# EAGLE design p0a-001 (EAGLE 9.6.2)
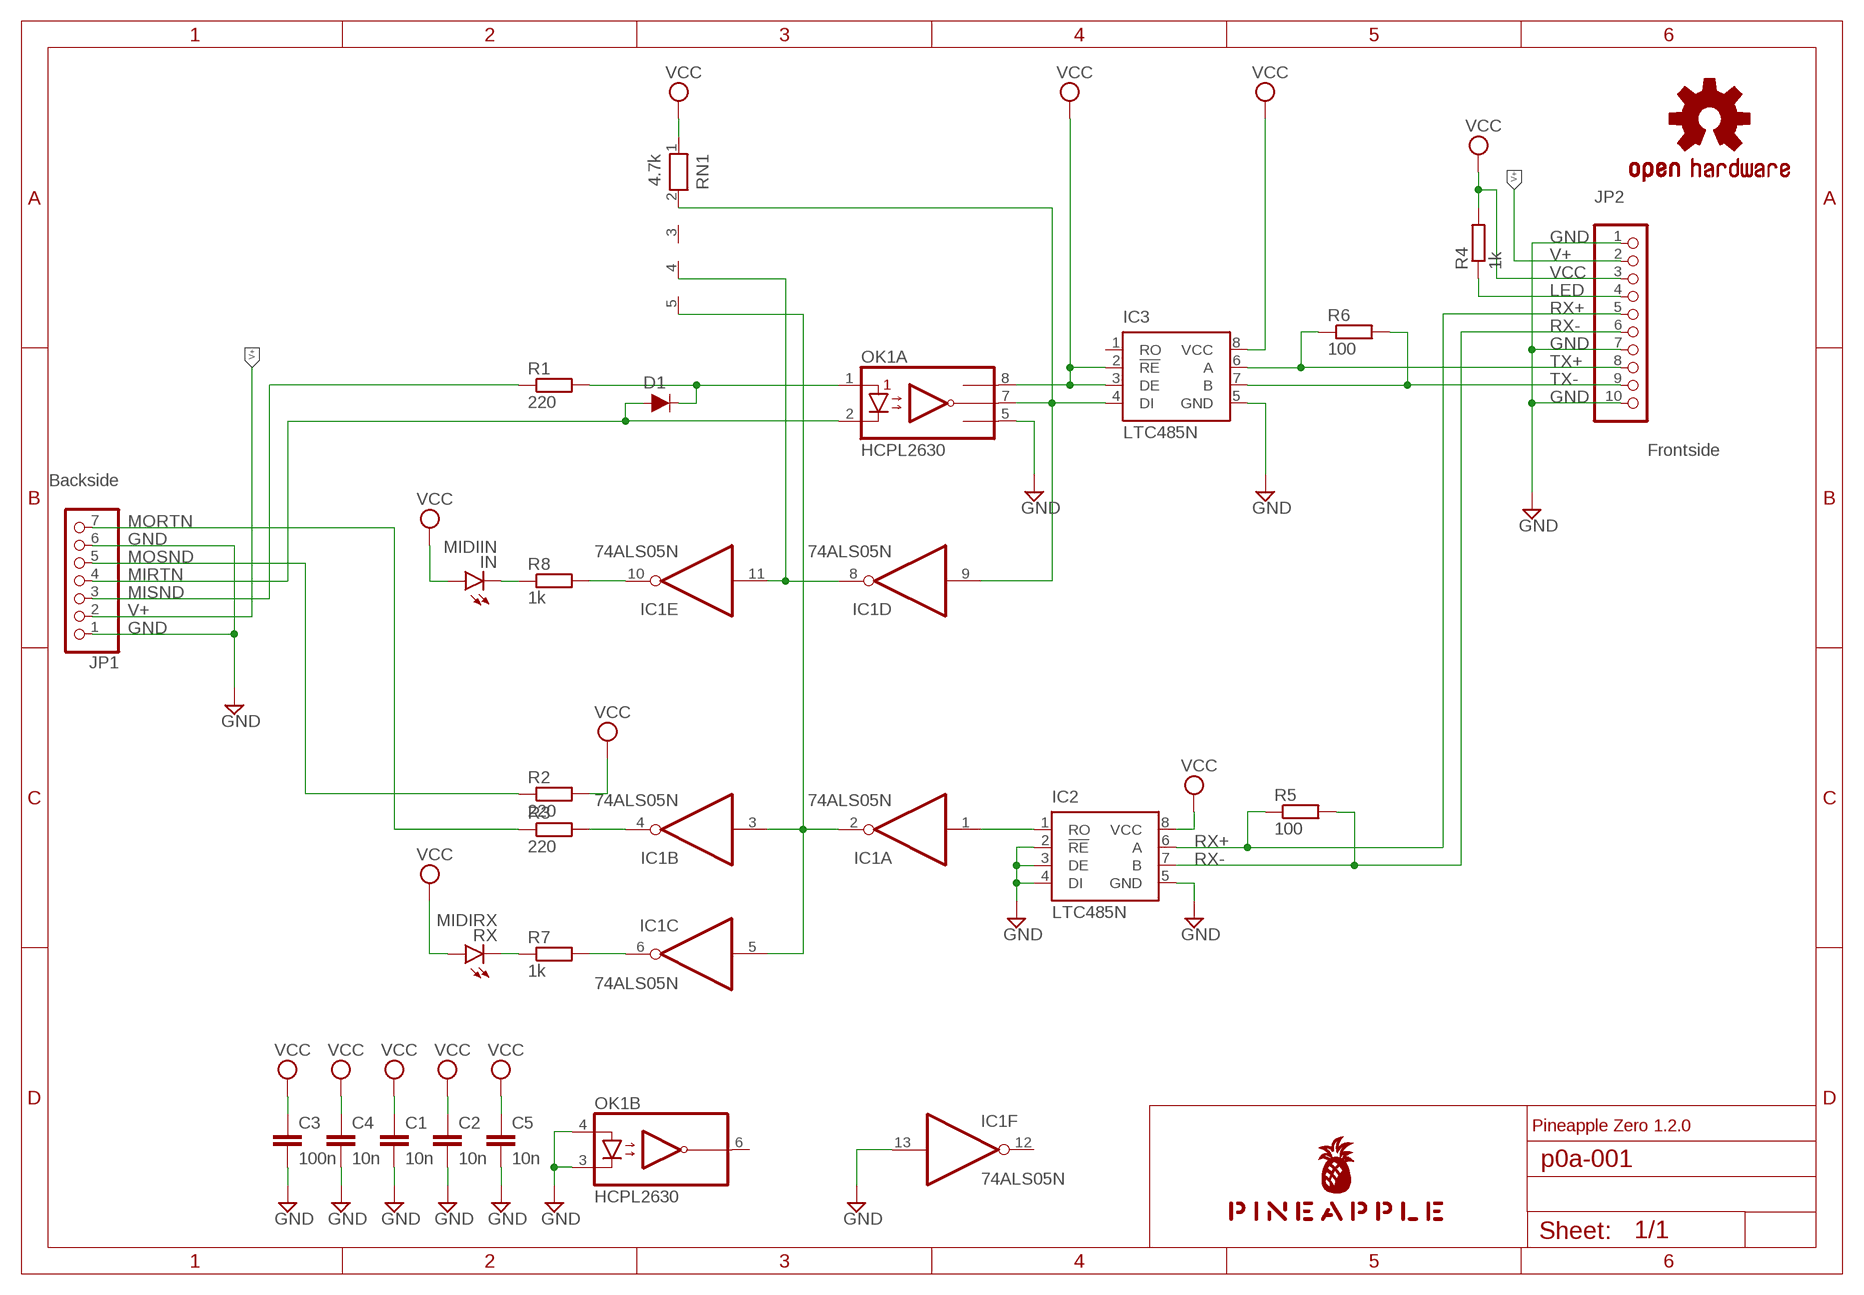
[diagram p0: schematic, sheet 1]

## Parts
C1  10n  C-EU025-024X044  [C025-024X044]
C2  10n  C-EU025-024X044  [C025-024X044]
C3  100n  C-EU025-024X044  [C025-024X044]
C4  10n  C-EU025-024X044  [C025-024X044]
C5  10n  C-EU025-024X044  [C025-024X044]
D1  DIODE-1N4148  [DIODE-1N4148]
IC1  74ALS05N  [DIL14]
IC2  LTC485N  [DIL08]
IC3  LTC485N  [DIL08]
IN  MIDIIN  LEDB152  [Q62902-B152]
JP1  Backside  PINHD-1X7  [1X07]
JP2  Frontside  PINHD-1X10  [1X10]
LOGO1  OSHW-LOGOS-COPPER  [OSHW-LOGO-S_COPPER]
OK1  HCPL2630  [DIL08]
R1  220  R-EU_0204/5  [0204/5]
R2  220  R-EU_0204/5  [0204/5]
R3  220  R-EU_0204/5  [0204/5]
R4  1k  R-EU_0204/5  [0204/5]
R5  100  R-EU_0204/5  [0204/5]
R6  100  R-EU_0204/5  [0204/5]
R7  1k  R-EU_0204/5  [0204/5]
R8  1k  R-EU_0204/5  [0204/5]
RN1  4.7k  RN04  [RN-5]
RX  MIDIRX  LEDB152  [Q62902-B152]
U$1  PINEAPPLE450  [PINEAPPLE450]

## Nets
GND [gnd]: C1.2 C2.2 C3.2 C4.2 C5.2 IC1.13(F:I) IC2.2(!RE) IC2.3(DE) IC2.4(DI) IC2.5(GND) IC3.5(GND) JP1.1 JP1.6 JP2.1 JP2.7 JP2.10 OK1.3(B:C2) OK1.4(B:A2) OK1.5(A:GND)
LED: JP2.4 R4.1
LED1: IC1.6(C:O) R7.2
LED1K: R7.1 RX.K(C)
LED2: IC1.10(E:O) R8.2
LED2K: IN.K(C) R8.1
MIDIIN: D1.C OK1.1(A:A1) R1.2
MIRTN: D1.A JP1.4 OK1.2(A:C1)
MISND: JP1.3 R1.1
MORTN: JP1.7 R3.1
MOSND: JP1.5 R2.1
N$1: IC1.1(A:I) IC2.1(RO)
N$2: IC1.4(B:O) R3.2
N$5: IC1.8(D:O) IC1.11(E:I) RN1.4
NMIDIOUT: IC1.2(A:O) IC1.3(B:I) IC1.5(C:I) RN1.5
RX+: IC2.6(A) JP2.5 R5.1
RX-: IC2.7(B) JP2.6 R5.2
TX: IC1.9(D:I) IC3.4(DI) OK1.7(A:VO1) RN1.2
TX+: IC3.6(A) JP2.8 R6.1
TX-: IC3.7(B) JP2.9 R6.2
V+ [gnd]: JP1.2 JP2.2
VCC [pwr]: C1.1 C2.1 C3.1 C4.1 C5.1 IC2.8(VCC) IC3.2(!RE) IC3.3(DE) IC3.8(VCC) IN.A JP2.3 OK1.8(A:VCC) R2.2 R4.2 RN1.1 RX.A
Unconnected: IC1.12(F:O) IC3.1(RO) OK1.6(B:VO2) RN1.3

## Notes on the sheet
- Pineapple Zero 1.2.0

## Power pins joined to a net without a drawn wire
GND: IC1.7(P:GND)
VCC: IC1.14(P:VCC)

## Library data of the parts
C1-C5 = rcl:C-EU: CAPACITOR, European symbol; SPICEPREFIX: C
D1 = SparkFun-DiscreteSemi:DIODE: Diode These are standard reverse protection diodes and small signal diodes. SparkFun Products: SparkFun SparkPunk Sound Kit <https://www.sparkfun.com/products/11177> SparkFun ESP8266 Thing <https://www.sparkfun.com/products/13231>; PROD_ID: DIO-08378; VALUE: 200mA/100V/1V
IC1 = 74xx-us:74*05: Hex INVERTER, open collector
IC2 IC3 = linear-technology:LTC485: Low Power RS485 Interface Transceiver Source: http://www.linear.com/pc/downloadDocument.do?navId=H0,C1,C1007,C1017,P2064,D1718; OC_FARNELL: unknown; OC_NEWARK: unknown
IN RX = led:LED: LED OSRAM: - CHIPLED LG R971, LG N971, LY N971, LG Q971, LY Q971, LO R971, LY R971 LH N974, LH R974 LS Q976, LO Q976, LY Q976 LO Q996 - Hyper CHIPLED LW Q18S LB Q993, LB Q99A, LB R99A - SideLED LS A670, LO A670, LY A670, LG A670, LP A670 LB A673, LV A673, LT A673, LW A673 LH A674 LY A675 LS A676, LA A676, LO A676, LY A676, LW A676 LS A679, LY A679, LG A679 - Hyper Micro SIDELED® LS Y876, LA Y876, LO Y876, LY Y876 LT Y87S - SmartLED LW L88C, LW L88S LB L89C, LB L89S, LG L890 LS L89K, LO L89K, LY L89K LS L896, LA L896, LO L896, LY L896 - TOPLED LS T670, LO T670, LY T670, LG T670, LP T670 LSG T670, LSP T670, LSY T670, LOP T670, LYG T670 LG T671, LOG T671, LSG T671 LB T673, LV T673, LT T673, LW T673 LH T674 LS T676, LA T676, LO T676, LY T676, LB T676, LH T676, LSB T676, LW T676 LB T67C, LV T67C, LT T67C, LS T67K, LO T67K, LY T67K, LW E67C LS E67B, LA E67B, LO E67B, LY E67B, LB E67C, LV E67C, LT E67C LW T67C LS T679, LY T679, LG T679 LS T770, LO T770, LY T770, LG T770, LP T770 LB T773, LV T773, LT T773, LW T773 LH T774 LS E675, LA E675, LY E675, LS T675 LS T776, LA T776, LO T776, LY T776, LB T776 LHGB T686 LT T68C, LB T68C - Hyper Mini TOPLED® LB M676 - Mini TOPLED Santana® LG M470 LS M47K, LO M47K, LY M47K Source: http://www.osram.convergy.de LUXEON: - LUMILED® LXK2-PW12-R00, LXK2-PW12-S00, LXK2-PW14-U00, LXK2-PW14-V00 LXK2-PM12-R00, LXK2-PM12-S00, LXK2-PM14-U00 LXK2-PE12-Q00, LXK2-PE12-R00, LXK2-PE12-S00, LXK2-PE14-T00, LXK2-PE14-U00 LXK2-PB12-K00, LXK2-PB12-L00, LXK2-PB12-M00, LXK2-PB14-N00, LXK2-PB14-P00, LXK2-PB14-Q00 LXK2-PR12-L00, LXK2-PR12-M00, LXK2-PR14-Q00, LXK2-PR14-R00 LXK2-PD12-Q00, LXK2-PD12-R00, LXK2-PD12-S00 LXK2-PH12-R00, LXK2-PH12-S00 LXK2-PL12-P00, LXK2-PL12-Q00, LXK2-PL12-R00 Source: www.luxeon.com KINGBRIGHT: KA-3528ASYC Source: www.kingbright.com
JP1 = pinhead:PINHD-1X7: PIN HEADER
JP2 = pinhead:PINHD-1X10: PIN HEADER
LOGO1 = SparkFun-Aesthetics:OSHW-LOGO: Open-Source Hardware (OSHW) Logo This logo indicates the piece of hardware it is found on incorporates a OSHW license and/or adheres to the definition of open source hardware found here: http://freedomdefined.org/OSHW
OK1 = optocoupler:HCPL2630: HEWLETT PACKARD OPTO COUPLER; MF: AGILENT TECHNOLOGIES; MPN: HCPL-2630-000E; OC_FARNELL: 9994904; OC_NEWARK: 88H7813
R1-R8 = rcl:R-EU_: RESISTOR, European symbol; SPICEPREFIX: R
RN1 = resistor-net:RN04: RESISTOR NETWORK; OC_FARNELL: unknown; OC_NEWARK: unknown
U$1 = pineapple:PINEAPPLE450

## Net classes
0 default: width 0.152 mm, drill 0.152 mm, clearance 0.152 mm
1 pwr: width 0.305 mm, drill 0.152 mm, clearance 0.152 mm
2 gnd: width 0.305 mm, drill 0.152 mm, clearance 0.152 mm

## Board
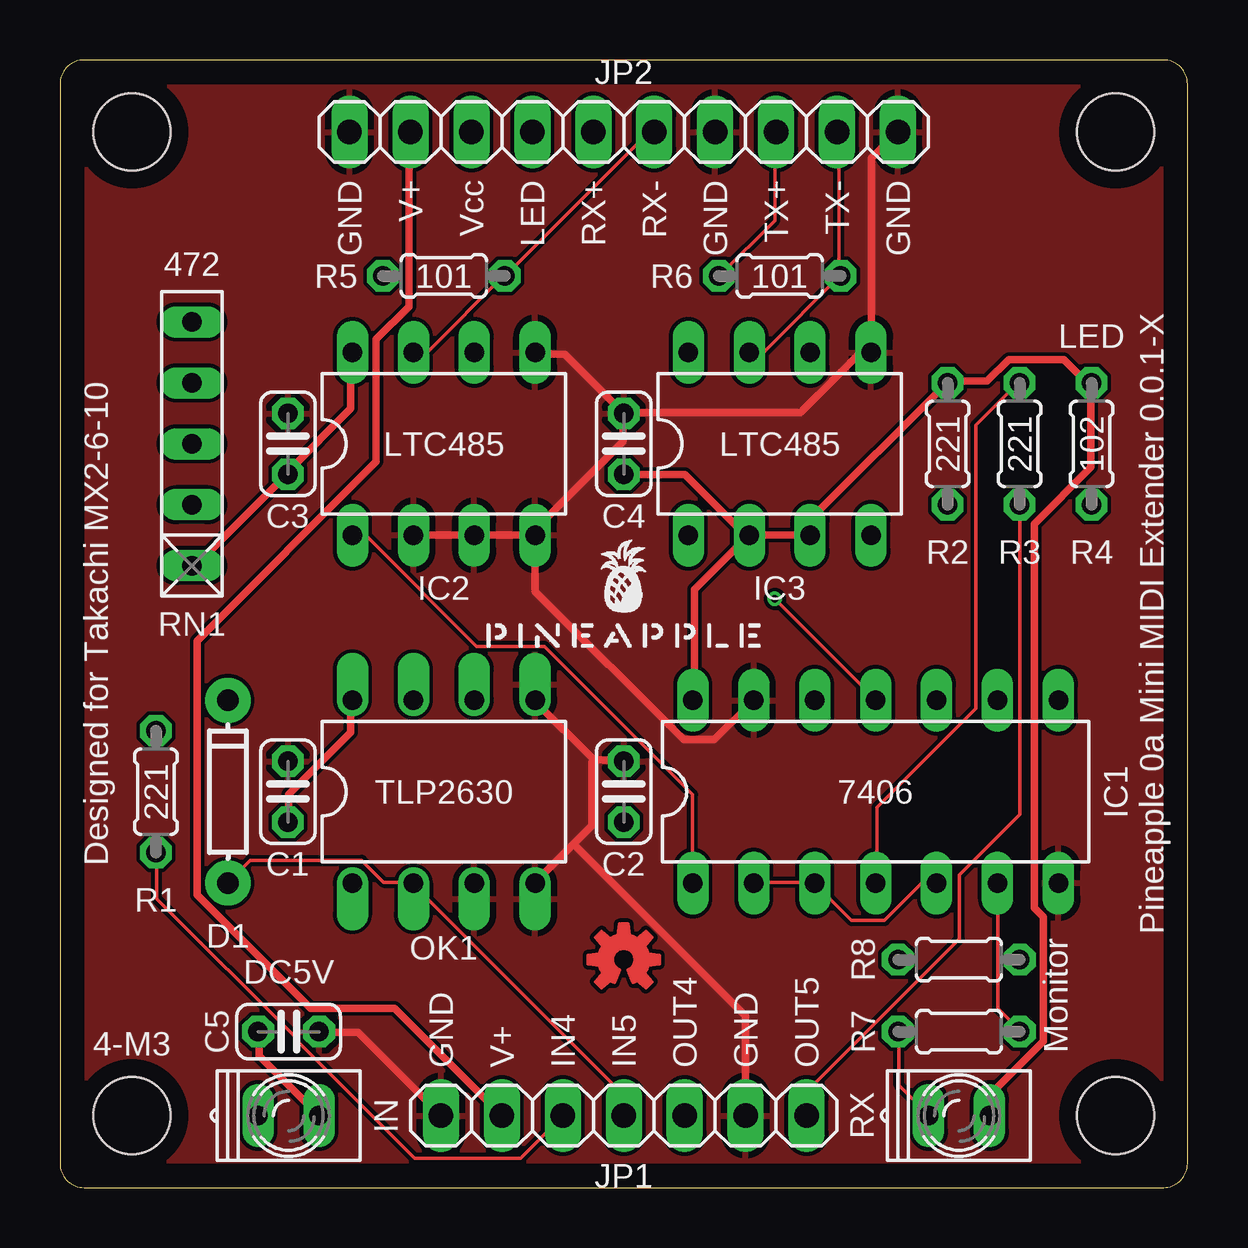
[diagram p1: board, top side]
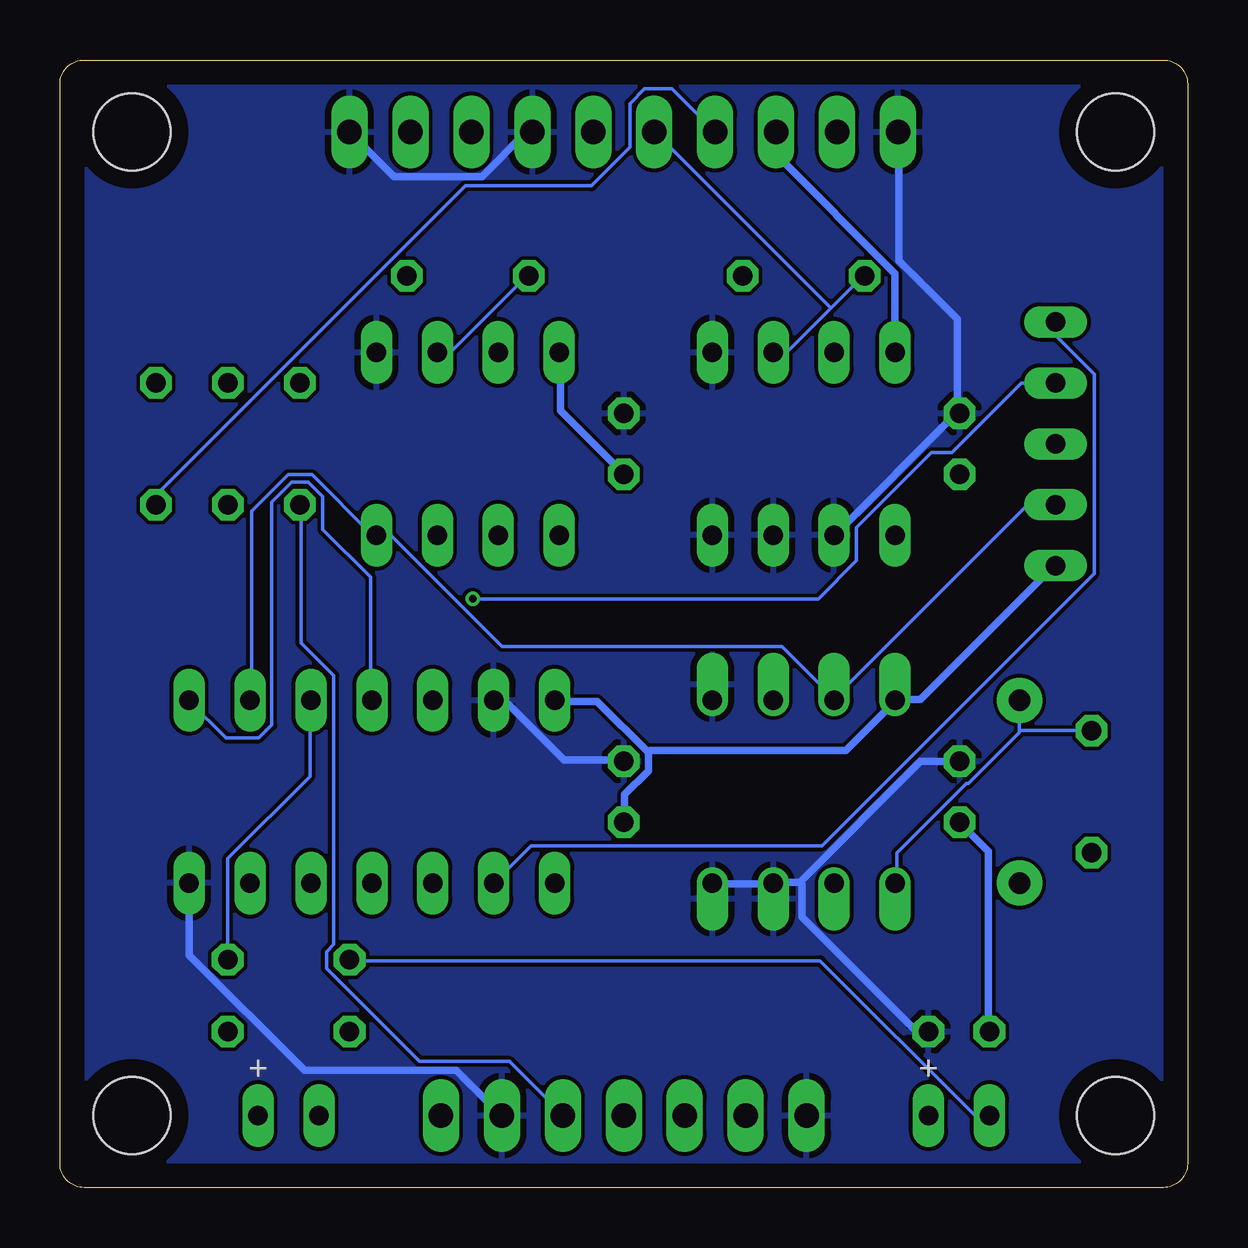
[diagram p2: board, bottom side, seen from below]

Size 47 x 47 mm. Coordinates in mm from the lower left corner, seen from the top.
Outline: 1,0 46,0 arc90 47,1 47,46 arc90 46,47 1,47 arc90 0,46 0,1 arc90 1,0
Copper layers (1*16): Top 0.035mm / dielectric 1.5mm / Bottom 0.035mm
Design rules "SeeedStudio_2layer_DRU_no_angle_20140221": minimum track width 6mil, minimum drill 12mil, track to track 6mil, track to pad 6mil, pad to pad 6mil, via to via 6mil, smd to smd 0mil, copper to edge 10mil, drill to drill 10mil, minimum pad ring 10mil, minimum via ring 6mil, stop-mask expansion 2mil, vias tented up to drill 100mil, thermal gap 10mil
Holes 3.2 mm at 3,3 44,3 44,44 3,44
tRestrict: area 0,0 to 1,47; area 0,46 to 47,47; area 46,0 to 47,47; area 0,0 to 47,1; area 0.8,41.8 to 5.2,46.2; area 0.8,0.8 to 5.2,5.2; area 41.8,0.8 to 46.2,5.2; area 41.8,41.8 to 46.2,46.2
bRestrict: area 0,46 to 47,47; area 46,0 to 47,47; area 0,0 to 47,1; area 0,0 to 1,47; area 0.8,0.8 to 5.2,5.2; area 41.8,0.8 to 46.2,5.2; area 41.8,41.8 to 46.2,46.2; area 0.8,41.8 to 5.2,46.2

### Footprints (pad centres in the part's own frame; a part is rotated, then mirrored left to right if it is on the bottom)
C025-024X044 = drill 0.813 octagon: 1 -1.27,0; 2 1.27,0
DIODE-1N4148 = drill 0.9 pad 1.88: A -3.81,0; C 3.81,0
DIL14 = drill 0.813 long: 1 -7.62,-3.81; 2 -5.08,-3.81; 3 -2.54,-3.81; 4 0,-3.81; 5 2.54,-3.81; 6 5.08,-3.81; 7 7.62,-3.81; 8 7.62,3.81; 9 5.08,3.81; 10 2.54,3.81; 11 0,3.81; 12 -2.54,3.81; 13 -5.08,3.81; 14 -7.62,3.81
DIL08 = drill 0.813 long: 1 -3.81,-3.81; 2 -1.27,-3.81; 3 1.27,-3.81; 4 3.81,-3.81; 5 3.81,3.81; 6 1.27,3.81; 7 -1.27,3.81; 8 -3.81,3.81
Q62902-B152 = drill 0.813 long: A 1.27,0; K -1.27,0
1X07 = drill 1.016 long: 1 -7.62,0; 2 -5.08,0; 3 -2.54,0; 4 0,0; 5 2.54,0; 6 5.08,0; 7 7.62,0
1X10 = drill 1.016 long: 1 -11.43,0; 2 -8.89,0; 3 -6.35,0; 4 -3.81,0; 5 -1.27,0; 6 1.27,0; 7 3.81,0; 8 6.35,0; 9 8.89,0; 10 11.43,0
DIL08' = drill 0.813 offset: 1 -3.81,-3.81; 2 -1.27,-3.81; 3 1.27,-3.81; 4 3.81,-3.81; 5 3.81,3.81; 6 1.27,3.81; 7 -1.27,3.81; 8 -3.81,3.81
0204/5 = drill 0.813 octagon: 1 -2.54,0; 2 2.54,0
RN-5 = drill 0.813 long: 1 -5.08,0; 2 -2.54,0; 3 0,0; 4 2.54,0; 5 5.08,0

### Placement (x,y rotation side)
C1  9.5,16.5 90 top
C2  23.5,16.5 90 top
C3  9.5,31 90 top
C4  23.5,31 90 top
C5  9.53,6.5 0 top
D1  7,16.5 90 top
IC1  34,16.5 0 top
IC2  16,31 0 top
IC3  30,31 0 top
IN  9.53,3 0 top
JP1  23.5,3 0 top
JP2  23.5,44 0 top
LOGO1  23.5,9.5 0 top
OK1  HCPL2630  [DIL08']  16,16.5 0 top
R1  4,16.5 90 top
R2  37,31 90 top
R3  40,31 90 top
R4  43,31 90 top
R5  16,38 0 top
R6  30,38 0 top
R7  37.47,6.5 0 top
R8  37.47,9.5 0 top
RN1  5.5,31 90 top
RX  37.47,3 0 top
U$1  23.5,22.5 0 top

### Tracks (layer width: path | path; a pad name or v marks a point on that pad's centre or on a via)
GND
  Top 0.305: JP2.10 34.9,43.97 33.83,42.9 33.83,34.82 IC3.5 33.68,34.75 33.3,34.75 30.86,32.31 23.62,32.31 C4.2 | IC2.5 19.81,34.75 21.03,34.75 23.47,32.31 C4.2 | IC2.2 14.78,27.2 17.22,27.2 IC2.3 17.37,27.2 19.74,27.2 IC2.4 | C4.2 23.47,32.16 23.47,31.09 19.74,27.36 IC2.4 | 22.25,17.83 23.47,17.83 C2.2 | 22.25,17.83 19.81,20.27 OK1.5 | C5.2 10.82,6.48 12.42,6.48 15.85,3.05 JP1.1 | 21.41,14.33 19.81,12.72 OK1.4 | 21.41,14.33 22.17,15.09 22.17,17.75 22.25,17.83 | 21.41,14.33 28.57,7.16 28.57,3.05 JP1.6 | IC2.4 19.81,27.05 19.81,24.84 25.98,18.67 27.28,18.67 28.88,20.27 IC1.13
  Bottom 0.305: JP2.7 27.36,43.97 27.58,43.97 29.41,42.14 33.07,42.14 34.9,43.97 JP2.10 | IC2.2 14.71,27.2 9.68,32.23 9.53,32.23 C3.2 9.6,32.38 9.6,36.2 12.04,38.63 12.04,43.97 JP2.1 | IC1.7 41.6,12.65 41.6,9.68 36.8,4.88 30.48,4.88 28.65,3.05 JP1.6 | IC1.13 28.88,20.27 28.42,20.27 25.98,17.83 23.55,17.83 C2.2 | 16.15,12.72 11.12,17.75 9.53,17.75 C1.2 | 16.15,12.72 17.22,12.72 OK1.3 17.37,12.65 19.74,12.65 OK1.4 | C5.2 10.82,6.55 11.35,6.55 16.08,11.28 16.08,12.65 16.15,12.72
  pour Top: -0.5,-0.5 47.5,-0.5 47.5,47.5 -0.5,47.5
  pour Bottom: -1,-1 48,-1 48,48 -1,48
LED
  Bottom 0.152: R4.1 42.98,28.5 42.98,28.88 30.1,41.76 24.84,41.76 23.24,43.36 23.24,45.19 22.63,45.8 21.49,45.8 19.74,44.04 JP2.4
LED1
  Top 0.152: IC1.6 39.09,12.65 39.09,7.47 40.01,6.55 R7.2
LED1K
  Top 0.152: R7.1 34.98,6.48 34.98,4.27 36.2,3.05 RX.K
LED2
  Bottom 0.152: IC1.10 36.58,20.27 36.58,17.14 40.01,13.72 40.01,9.53 R8.2
LED2K
  Bottom 0.152: IN.K 8.31,3.05 8.91,3.05 15.32,9.45 34.9,9.45 R8.1
MIDIIN
  Bottom 0.152: 7.01,19.05 7.01,20.27 D1.C | 7.01,19.05 7.01,18.97 9.14,16.84 9.22,16.84 12.12,13.95 12.12,12.72 OK1.1 | 7.01,19.05 4.04,19.05 R1.2
MIRTN
  Top 0.152: D1.A 7.01,12.72 7.92,13.64 12.57,13.64 13.49,12.72 14.71,12.72 OK1.2 14.71,12.65 23.47,3.89 23.47,3.05 JP1.4
MISND
  Top 0.152: R1.1 4.04,13.95 4.04,12.04 9.91,6.17 9.91,6.1 14.78,1.22 19.2,1.22 20.95,2.97 JP1.3
MORTN
  Top 0.152: R3.1 40.01,28.42 40.01,15.54 37.49,13.03 37.49,10.36 31.17,4.04 31.17,3.05 JP1.7
MOSND
  Bottom 0.152: R2.1 36.96,28.42 36.96,22.71 35.59,21.34 35.59,10.13 35.89,9.83 35.89,9.14 32,5.26 28.27,5.26 26.06,3.05 JP1.5
N$1
  Top 0.152: IC2.1 12.19,27.13 12.8,27.13 17.37,22.55 20.19,22.55 26.36,16.38 26.36,12.72 IC1.1
N$2
  Top 0.152: IC1.4 34.06,12.72 34.06,15.85 38.18,19.96 38.18,31.77 39.93,33.53 R3.2
N$5  (via drill 0.3)
  Top 0.152: v29.79,24.54 33.98,20.34 IC1.11
  Bottom 0.152: IC1.11 34.06,20.34 34.06,25.45 36.04,27.43 36.04,28.8 36.65,29.41 37.34,29.41 38.18,28.57 38.18,19.28 38.71,18.75 40.08,18.75 41.6,20.27 IC1.8 | v29.79,24.54 15.39,24.54 13.79,26.14 13.79,27.51 10.67,30.63 9.83,30.63 6.93,33.53 5.56,33.53 RN1.4
NMIDIOUT
  Top 0.152: IC1.2 28.96,12.72 31.39,12.72 IC1.3 31.47,12.65 32.99,11.12 34.37,11.12 35.89,12.65 36.5,12.65 IC1.5
  Bottom 0.152: RN1.5 5.49,36.04 5.49,35.51 3.89,33.91 3.89,25.6 15.24,14.25 27.36,14.25 28.88,12.72 IC1.2
RX+
  Bottom 0.152: 14.86,36.65 13.49,38.02 R5.1 | 14.86,36.65 16.69,34.82 17.22,34.82 IC2.6 | 14.86,36.65 22.17,43.97 JP2.5
RX-
  Top 0.152: IC2.7 14.78,34.82 15.32,34.82 18.52,38.02 R5.2 18.59,38.02 24.54,43.97 24.77,43.97 JP2.6
TX
  Bottom 0.152: IC1.9 39.01,20.34 39.01,28.19 37.49,29.72 36.5,29.72 33.98,27.2 33.83,27.2 IC3.4 33.76,27.13 33.15,27.13 28.57,22.55 16.92,22.55 14.78,20.42 OK1.7 14.78,20.34 6.71,28.42 5.56,28.42 RN1.2
TX+
  Top 0.152: JP2.8 29.79,43.97 29.79,40.31 27.51,38.02 R6.1
  Bottom 0.152: IC3.6 31.24,34.82 30.71,34.82 27.51,38.02 R6.1
TX-
  Top 0.152: IC3.7 28.8,34.82 29.34,34.82 32.54,38.02 R6.2 32.46,38.02 32.46,43.97 JP2.9
V+
  Top 0.305: JP2.2 14.55,43.97 14.55,36.73 13.18,35.36 13.18,30.25 5.71,22.78 5.71,12.19 10.44,7.47 13.95,7.47 18.36,3.05 JP1.2
VCC
  Top 0.305: IC3.2 28.8,27.2 31.24,27.2 IC3.3 31.24,27.36 31.24,27.81 36.88,33.45 R2.2 37.03,33.6 38.63,33.6 39.55,34.52 41.83,34.52 42.82,33.53 R4.2 42.98,33.53 42.98,30.02 40.62,27.66 40.62,11.66 41,11.28 41,6.1 38.79,3.89 38.79,3.05 RX.A | C4.1 23.55,29.72 26.06,29.72 28.57,27.2 IC3.2 | IC1.14 26.44,20.34 26.44,24.92 28.57,27.05 IC3.2 | C5.1 8.31,6.48 8.31,5.49 10.74,3.05 IN.A | C1.1 9.53,15.24 9.53,16.38 12.12,18.97 12.12,20.27 OK1.8 | RN1.1 5.56,25.98 5.71,25.98 9.45,29.72 C3.1 9.53,29.87 12.12,32.46 12.12,34.75 IC2.8
  Bottom 0.305: 22.48,18.14 22.48,17.37 23.47,16.38 23.47,15.24 C2.1 | 22.48,18.14 24.61,20.27 26.36,20.27 IC1.14 | IC3.8 26.14,34.75 26.14,32.38 23.55,29.79 C4.1 | C5.1 8.31,6.55 8.31,14.02 9.45,15.16 C1.1 | JP2.3 17.14,43.97 17.14,43.05 12.19,38.1 12.19,34.82 IC2.8 | RN1.1 5.56,25.91 11.12,20.34 12.12,20.34 OK1.8 12.27,20.19 14.25,18.21 22.4,18.21 22.48,18.14

### Text on the board
tNames: GND | V+ | Vcc | LED | RX+ | RX- | GND | TX+ | TX- | GND | 472 | 101 | 101 | LED | LTC485 | LTC485 | 221 | 221 | 102 | Designed for Takachi MX2-6-10 | Pineapple 0a Mini MIDI Extender 0.0.1-X | 221 | TLP2630 | 7406 | DC5V | Monitor | 4-M3 | GND | V+ | IN4 | IN5 | OUT4 | GND | OUT5
bNames: + | +